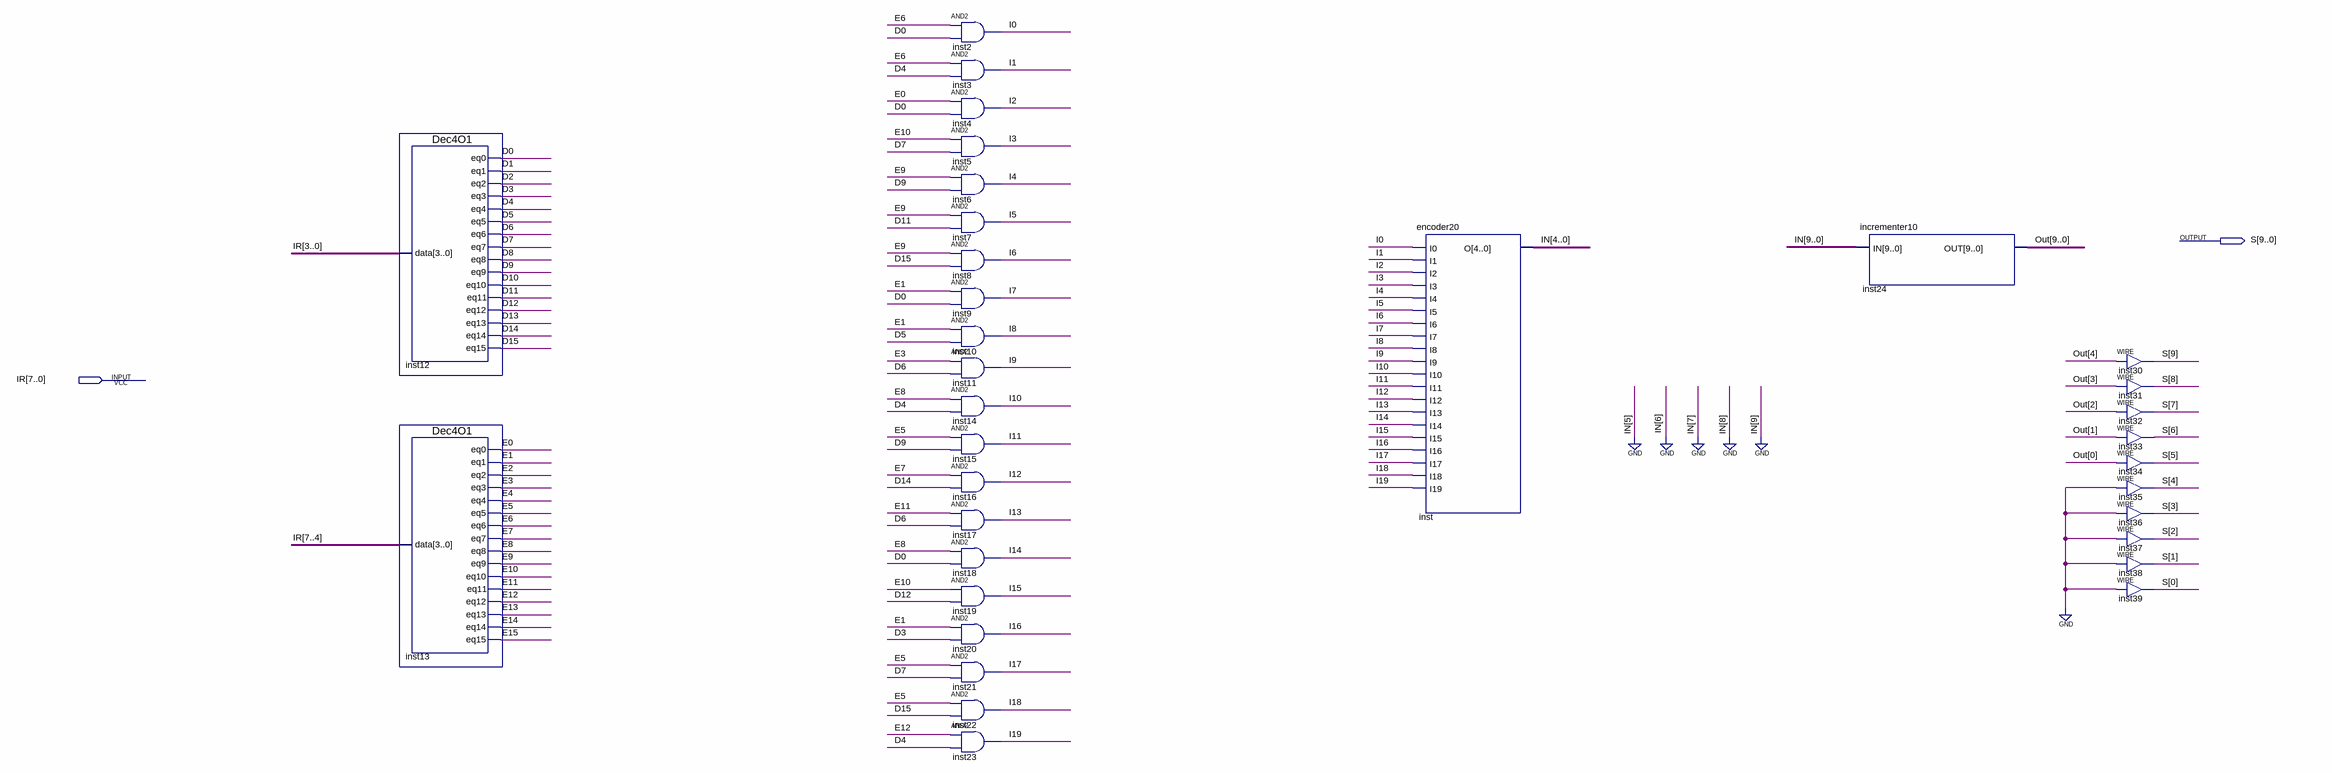
[diagram p0: schematic sheet]
// Quartus schematic addressMapper.bdf as structural Verilog: 34 symbols, 2 pins
module addressMapper (
  input  [7:0] IR,
  output [9:0] S
);

  wire D0, D1, D2, D3, D4, D5, D6, D7, D8, D9, D10, D11, D12, D13, D14, D15, E0, E1, E2, E3, E4, E5, E6, E7,
       E8, E9, E10, E11, E12, E13, E14, E15, I0, I1, I2, I3, I4, I5, I6, I7, I8, I9, I10, I11, I12, I13, I14,
       I15, I16, I17, I18, I19;
  wire [4:0] IN;
  wire [9:0] Out;

  Dec4O1 inst12 (
    .data(IR[3:0]), .eq0(D0), .eq1(D1), .eq2(D2), .eq3(D3), .eq4(D4), .eq5(D5), .eq6(D6), .eq7(D7), .eq8(D8),
    .eq9(D9), .eq10(D10), .eq11(D11), .eq12(D12), .eq13(D13), .eq14(D14), .eq15(D15));
  Dec4O1 inst13 (
    .data(IR[7:4]), .eq0(E0), .eq1(E1), .eq2(E2), .eq3(E3), .eq4(E4), .eq5(E5), .eq6(E6), .eq7(E7), .eq8(E8),
    .eq9(E9), .eq10(E10), .eq11(E11), .eq12(E12), .eq13(E13), .eq14(E14), .eq15(E15));
  and inst2 (I0, E6, D0);
  and inst3 (I1, E6, D4);
  and inst4 (I2, E0, D0);
  and inst5 (I3, E10, D7);
  and inst6 (I4, E9, D9);
  and inst7 (I5, E9, D11);
  and inst8 (I6, E9, D15);
  and inst9 (I7, E1, D0);
  and inst10 (I8, E1, D5);
  and inst11 (I9, E3, D6);
  and inst14 (I10, E8, D4);
  and inst15 (I11, E5, D9);
  and inst16 (I12, E7, D14);
  and inst17 (I13, E11, D6);
  and inst18 (I14, E8, D0);
  and inst19 (I15, E10, D12);
  and inst20 (I16, E1, D3);
  and inst21 (I17, E5, D7);
  and inst22 (I18, E5, D15);
  and inst23 (I19, E12, D4);
  encoder20 inst (
    .I0(I0), .I1(I1), .I2(I2), .I3(I3), .I4(I4), .I5(I5), .I6(I6), .I7(I7), .I8(I8), .I9(I9), .I10(I10),
    .I11(I11), .I12(I12), .I13(I13), .I14(I14), .I15(I15), .I16(I16), .I17(I17), .I18(I18), .I19(I19), .O(IN));
  incrementer10 inst24 (.IN({{5{1'b0}}, IN}), .OUT(Out));
  assign S[9] = Out[4];  // WIRE inst30
  assign S[8] = Out[3];  // WIRE inst31
  assign S[7] = Out[2];  // WIRE inst32
  assign S[6] = Out[1];  // WIRE inst33
  assign S[5] = Out[0];  // WIRE inst34
  assign S[4] = 1'b0;  // WIRE inst35
  assign S[3] = 1'b0;  // WIRE inst36
  assign S[2] = 1'b0;  // WIRE inst37
  assign S[1] = 1'b0;  // WIRE inst38
  assign S[0] = 1'b0;  // WIRE inst39
endmodule
